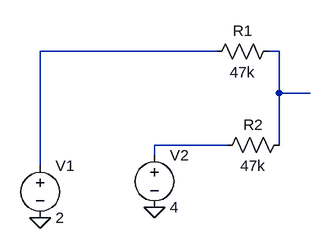
[diagram p0: schematic cумматор.asc]
cумматор.asc, the LTspice schematic file:
Version 4
SHEET 1 880 680
WIRE 224 48 -48 48
WIRE 320 48 304 48
WIRE 320 112 320 48
WIRE 368 112 320 112
WIRE 240 192 128 192
WIRE 320 192 320 112
WIRE 128 208 128 192
WIRE -48 224 -48 48
FLAG 128 288 0
FLAG -48 304 0
SYMBOL res 320 32 R90
WINDOW 0 0 56 VBottom 2
WINDOW 3 32 56 VTop 2
SYMATTR InstName R1
SYMATTR Value 47k
SYMBOL res 336 176 R90
WINDOW 0 0 56 VBottom 2
WINDOW 3 32 56 VTop 2
SYMATTR InstName R2
SYMATTR Value 47k
SYMBOL voltage -48 208 R0
WINDOW 123 0 0 Left 2
WINDOW 39 0 0 Left 2
SYMATTR InstName V1
SYMATTR Value 2
SYMBOL voltage 128 192 R0
WINDOW 123 0 0 Left 2
WINDOW 39 0 0 Left 2
SYMATTR InstName V2
SYMATTR Value 4

The netlist it stands for:
* cумматор.asc
R1 N002 N001 47k
R2 N002 N003 47k
V1 N001 0 2
V2 N003 0 4
.backanno
.end